# EAGLE design old_line_kick (EAGLE 7.7.0)
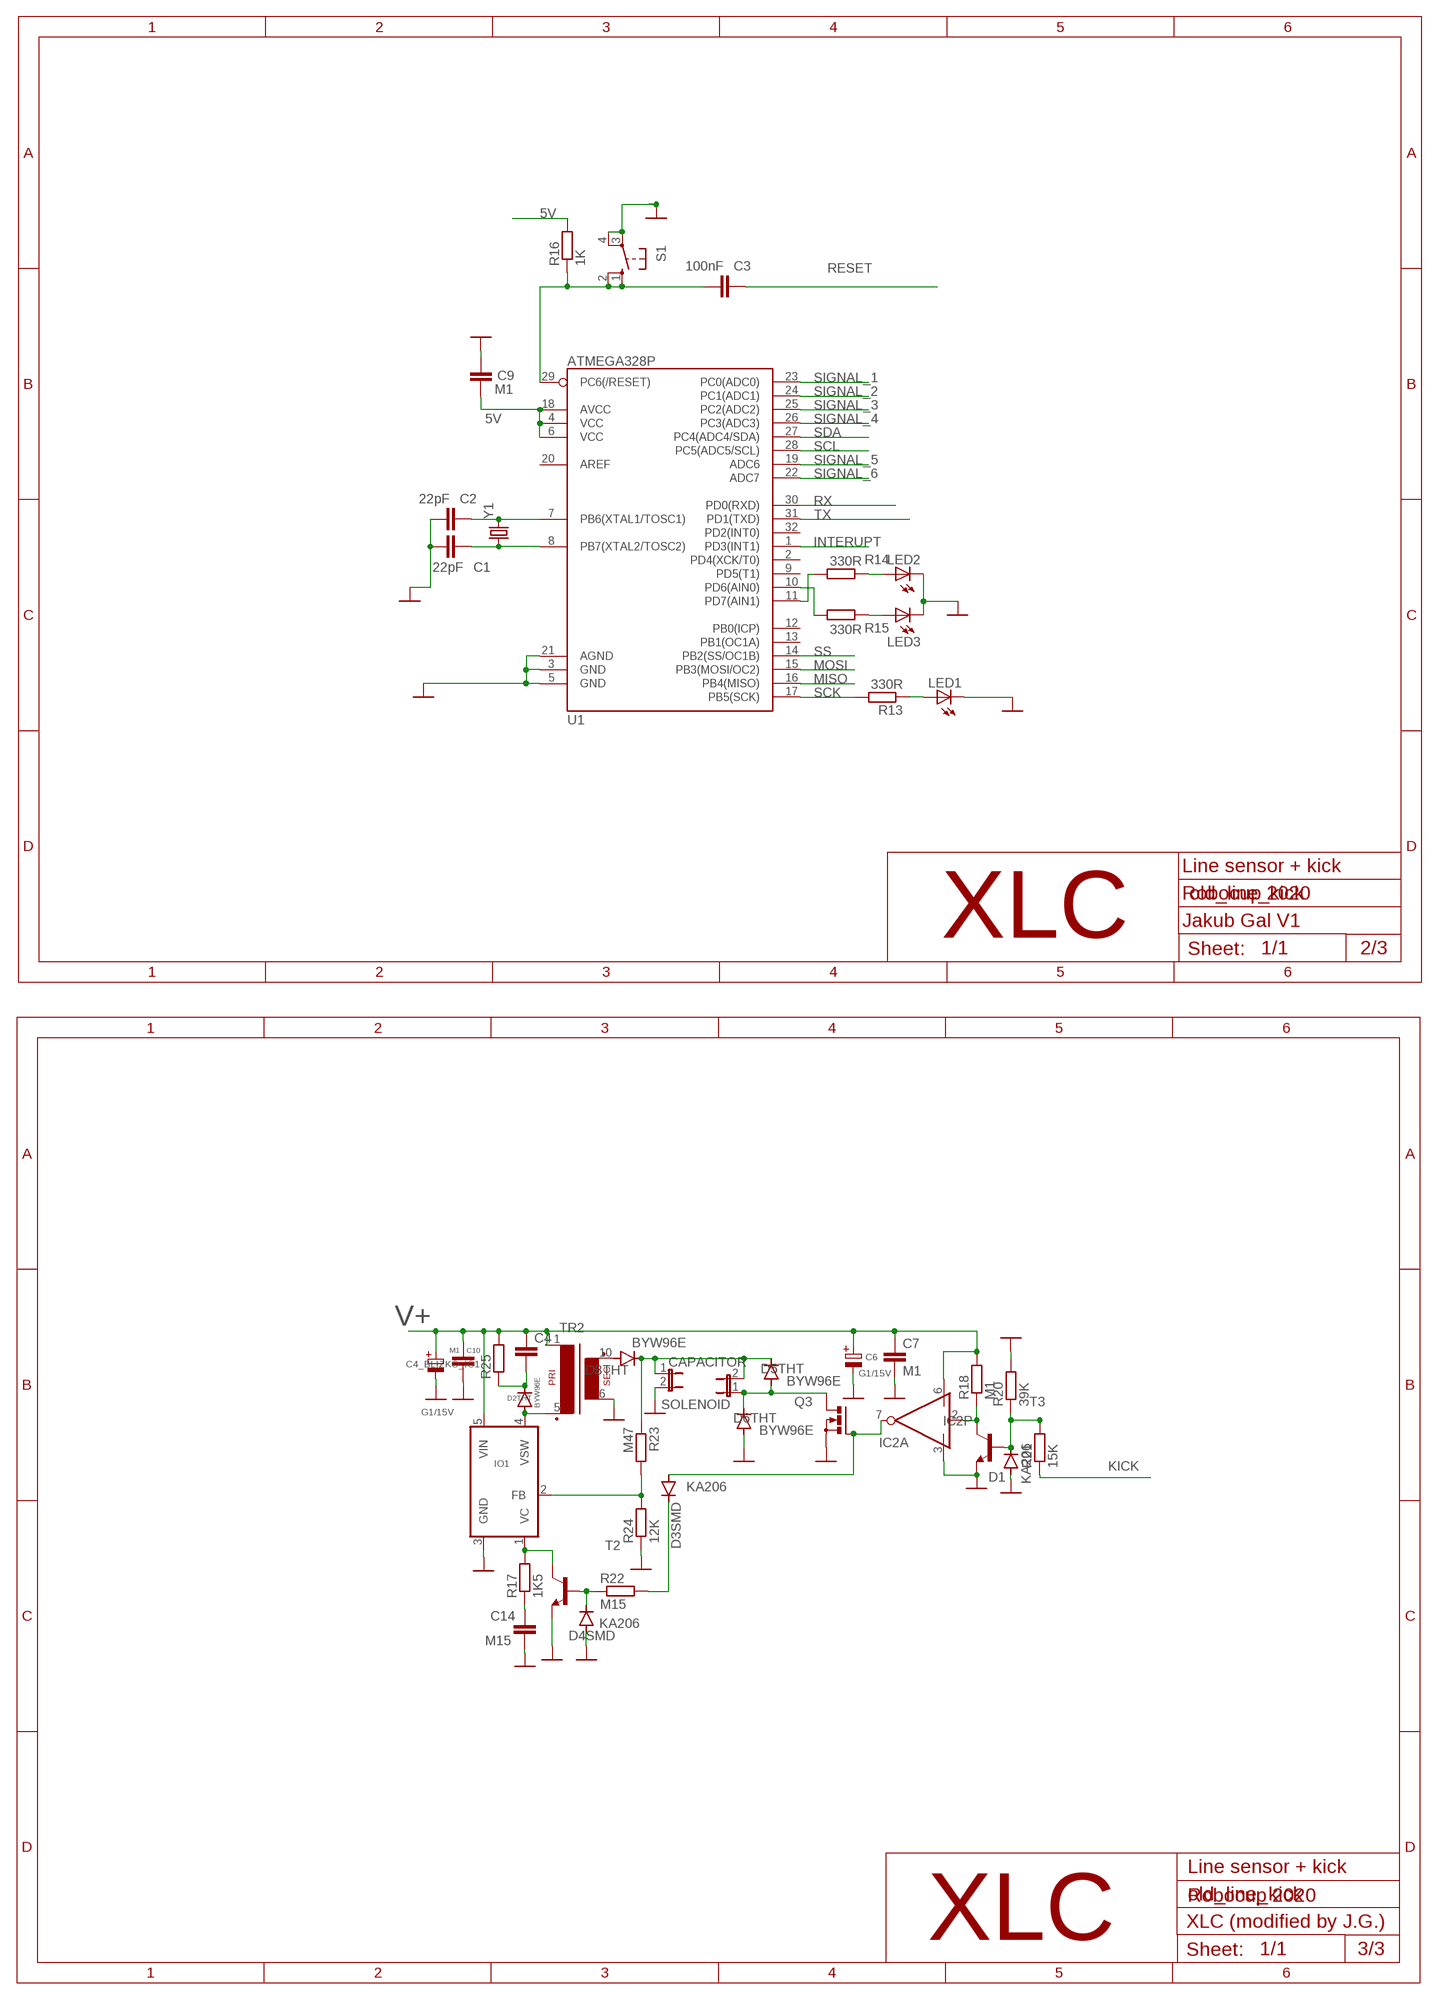
[diagram p0: schematic, sheet 1, part 1 of 2]
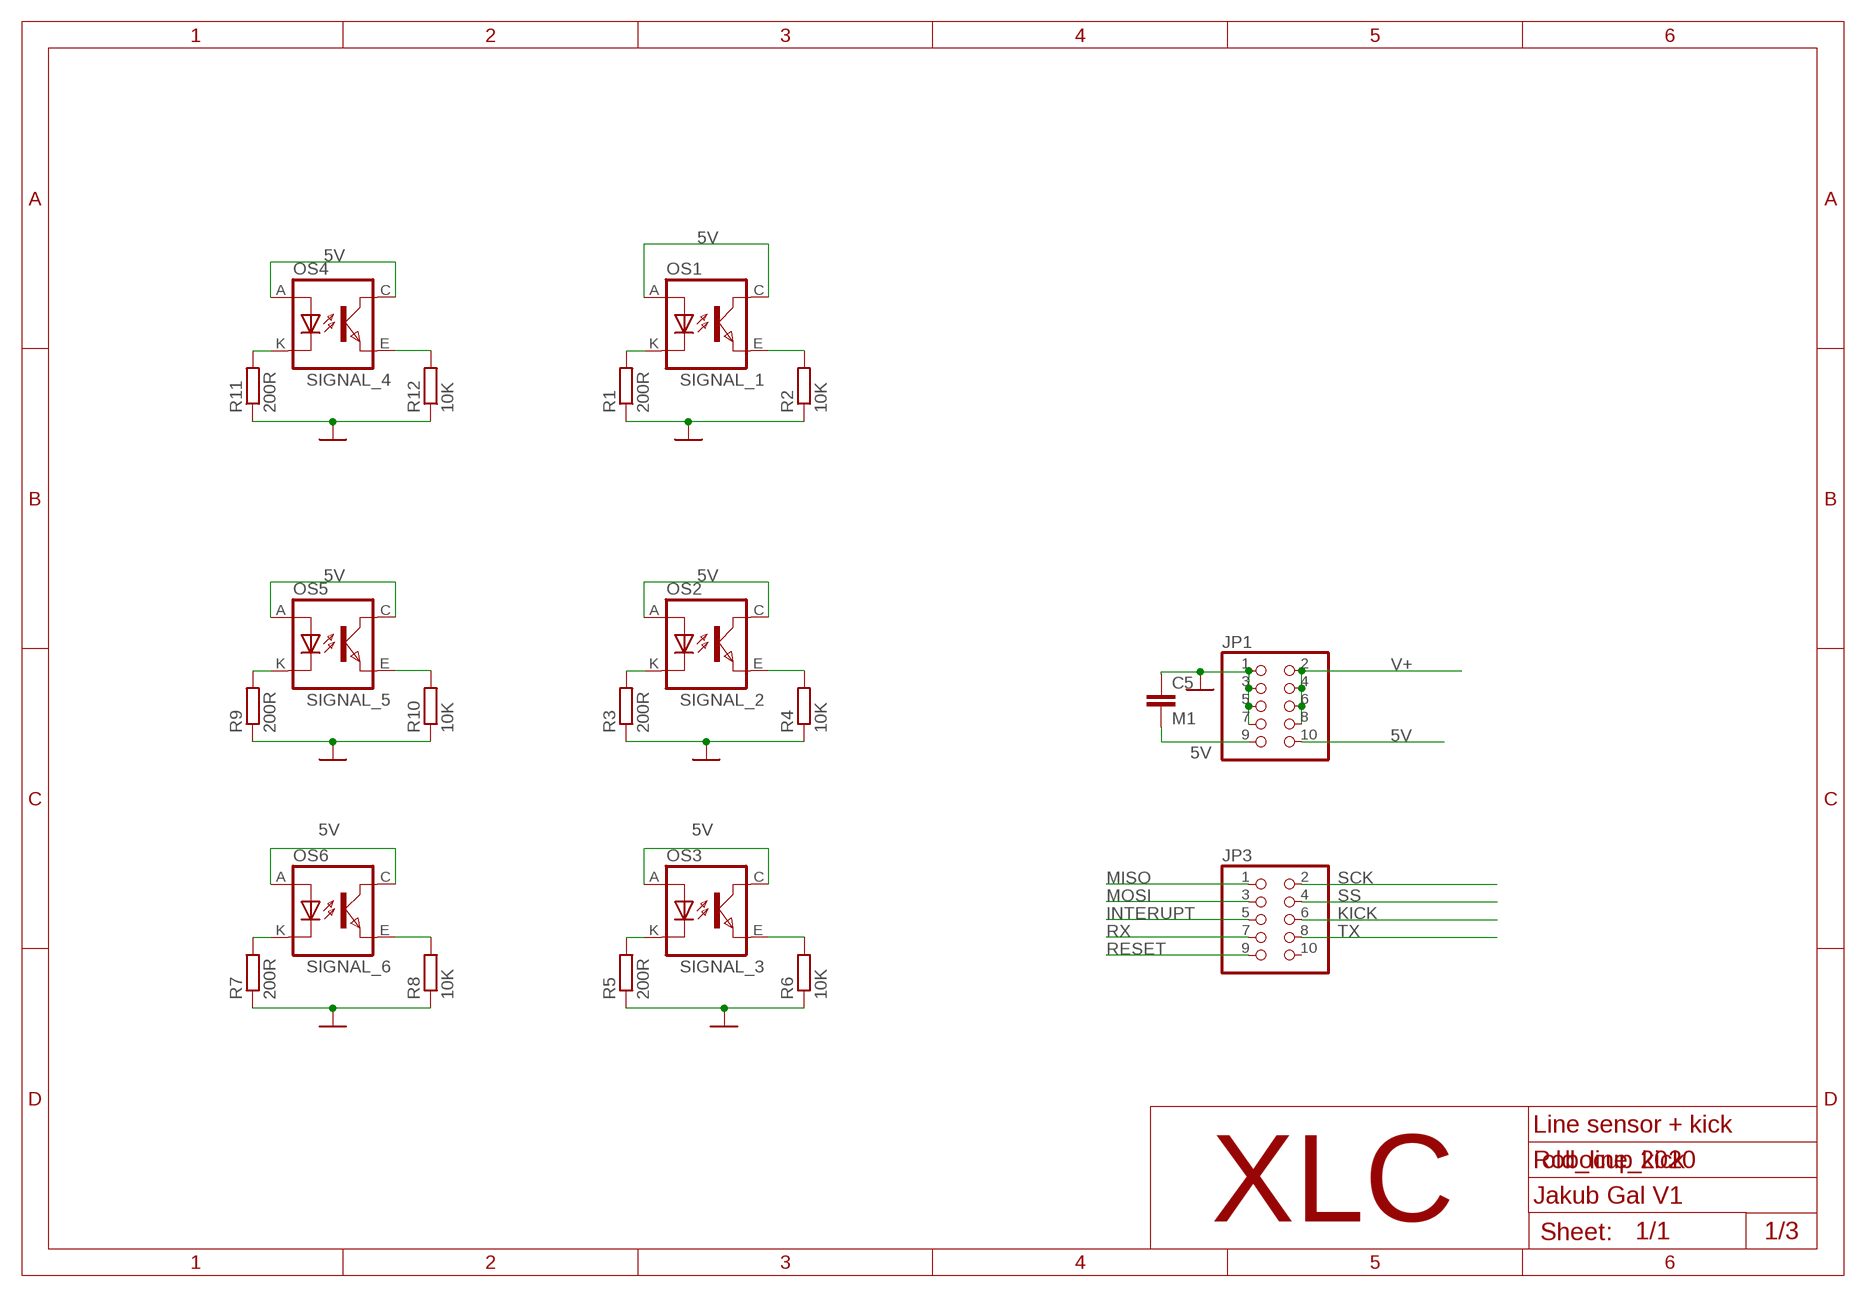
[diagram p1: schematic, sheet 1, part 2 of 2]

## Parts
C1  22pF  C-EUC0603  [C0603]
C2  22pF  C-EUC0603  [C0603]
C3  100nF  C-EUC0603  [C0603]
C4  C-EU075-052X106  [C075-052X106]
C4_BLIZKO_IO1  G1/15V  KOND-ELEKT-2,5/7  [E-2,5/7-RAD]
C5  M1  C-EUC0603  [C0603]
C6  G1/15V  KOND-ELEKT-2,5/7  [E-2,5/7-RAD]
C7  M1  C-EUC0805K  [C0805K]
C9  M1  C-EUC0603  [C0603]
C10  M1  C-EUC0805K  [C0805K]
C14  M15  C-EUC0805K  [C0805K]
CAPACITOR  JP1E  [JP1]
D1  KA206  DIODE-D-7.5  [D-7.5]
D2THT  BYW96E  BYW96  [SOD64-10]
D3SMD  KA206  DIODE-D-7.5  [D-7.5]
D4SMD  KA206  DIODE-D-7.5  [D-7.5]
D5THT  BYW96E  BYW96  [SOD64-10]
D6THT  BYW96E  BYW96  [SOD64-10]
D8THT  BYW96E  BYW96  [SOD64-10]
IC2  MIC4423BM  [SO08]
IO1  LT1071V  [TO220-5P]
JP1  PINHD-2X5IDC  [2X05_IDC]
JP3  PINHD-2X5IDC  [2X05_IDC]
LED1  LEDCHIPLED_0603  [CHIPLED_0603]
LED2  LEDCHIPLED_0603  [CHIPLED_0603]
LED3  LEDCHIPLED_0603  [CHIPLED_0603]
OS1  TCRT5000  [TCRT5000]
OS2  TCRT5000  [TCRT5000]
OS3  TCRT5000  [TCRT5000]
OS4  TCRT5000  [TCRT5000]
OS5  TCRT5000  [TCRT5000]
OS6  TCRT5000  [TCRT5000]
Q3  PMOSFET_NTO220BV  [TO220BV]
R1  200R  R-EU_R0603  [R0603]
R2  10K  R-EU_R0603  [R0603]
R3  200R  R-EU_R0603  [R0603]
R4  10K  R-EU_R0603  [R0603]
R5  200R  R-EU_R0603  [R0603]
R6  10K  R-EU_R0603  [R0603]
R7  200R  R-EU_R0603  [R0603]
R8  10K  R-EU_R0603  [R0603]
R9  200R  R-EU_R0603  [R0603]
R10  10K  R-EU_R0603  [R0603]
R11  200R  R-EU_R0603  [R0603]
R12  10K  R-EU_R0603  [R0603]
R13  330R  R-EU_R0603  [R0603]
R14  330R  R-EU_R0603  [R0603]
R15  330R  R-EU_R0603  [R0603]
R16  1K  R-EU_R0603  [R0603]
R17  1K5  R-EU_R1206  [R1206]
R18  M1  R-EU_R1206  [R1206]
R20  39K  R-EU_R1206  [R1206]
R21  15K  R-EU_R1206  [R1206]
R22  M15  R-EU_R1206  [R1206]
R23  M47  R-EU_R1206  [R1206]
R24  12K  R-EU_R1206  [R1206]
R25  REZISTOR-7,5MM-HORIZ  [R-7,5H]
S1  10-XX  [B3F-10XX]
SOLENOID  JP1E  [JP1]
T2  -NPN-SC59-BEC  [SC59-BEC]
T3  -NPN-SC59-BEC  [SC59-BEC]
TR2  TRAFO-E10-R""  [TRAFO-EE17X20]
U1  ATMEGA328P  ATMEGA328_SMT  [TQFP32-08]
Y1  CRYSTALHC49US  [HC49US]

## Nets
5V: C5.2 C9.1 JP1.9 JP1.10 OS1.A(ANODE) OS1.C(COLLECTOR) OS2.A(ANODE) OS2.C(COLLECTOR) OS3.A(ANODE) OS3.C(COLLECTOR) OS4.A(ANODE) OS4.C(COLLECTOR) OS5.A(ANODE) OS5.C(COLLECTOR) OS6.A(ANODE) OS6.C(COLLECTOR) R16.2 U1.4(VCC) U1.6(VCC) U1.18(AVCC)
GND: C1.1 C2.1 C4_BLIZKO_IO1.- C5.1 C6.- C7.2 C9.2 C10.2 C14.2 CAPACITOR.2 D1.A D4SMD.A D6THT.A IC2.3(P:GND) IO1.3(GND) JP1.1 JP1.3 JP1.5 JP1.7 LED1.C LED2.C LED3.C Q3.S R1.1 R2.1 R3.1 R4.1 R5.1 R6.1 R7.1 R8.1 R9.1 R10.1 R11.1 R12.1 R20.2 R24.1 S1.3(P) S1.4(P1) T2.E T3.E TR2.6 U1.3(GND) U1.5(GND) U1.21(AGND)
INTERUPT: JP3.5 U1.1(PD3(INT1))
KICK: JP3.6 R21.1
MISO: JP3.1 U1.16(PB4(MISO))
MOSI: JP3.3 U1.15(PB3(MOSI/OC2))
N$1: OS1.K(CATHODE) R1.2
N$2: OS2.K(CATHODE) R3.2
N$3: OS3.K(CATHODE) R5.2
N$4: OS6.K(CATHODE) R7.2
N$5: OS5.K(CATHODE) R9.2
N$6: OS4.K(CATHODE) R11.2
N$7: C2.2 U1.7(PB6(XTAL1/TOSC1)) Y1.2
N$8: C1.2 U1.8(PB7(XTAL2/TOSC2)) Y1.1
N$9: IO1.1(VC) R17.2 T2.C
N$10: C14.1 R17.1
N$11: D8THT.A TR2.10
N$12: D3SMD.A IC2.7(A:OUT) Q3.G
N$13: CAPACITOR.1 D5THT.C D8THT.C R23.1 SOLENOID.2
N$14: IO1.2(FB) R23.2 R24.2
N$15: D4SMD.C R22.1 T2.B
N$16: C3.1 R16.1 S1.1(S) S1.2(S1) U1.29(PC6(/RESET))
N$17: LED1.A R13.1
N$18: IC2.2(A:IN) R18.1 T3.C
N$19: LED2.A R14.1
N$20: R15.2 U1.10(PD6(AIN0))
N$21: LED3.A R15.1
N$22: R14.2 U1.11(PD7(AIN1))
N$23: D2THT.A IO1.4(VSW) TR2.5
N$24: C4.2 D2THT.C R25.1
N$26: D5THT.A D6THT.C Q3.D SOLENOID.1
N$29: D3SMD.C R22.2
N$31: D1.C R20.1 R21.2 T3.B
RESET: C3.2 JP3.9
RX: JP3.7 U1.30(PD0(RXD))
SCK: JP3.2 R13.2 U1.17(PB5(SCK))
SCL: U1.28(PC5(ADC5/SCL))
SDA: U1.27(PC4(ADC4/SDA))
SIGNAL_1: OS1.E(EMITTER) R2.2 U1.23(PC0(ADC0))
SIGNAL_2: OS2.E(EMITTER) R4.2 U1.24(PC1(ADC1))
SIGNAL_3: OS3.E(EMITTER) R6.2 U1.25(PC2(ADC2))
SIGNAL_4: OS4.E(EMITTER) R12.2 U1.26(PC3(ADC3))
SIGNAL_5: OS5.E(EMITTER) R10.2 U1.19(ADC6)
SIGNAL_6: OS6.E(EMITTER) R8.2 U1.22(ADC7)
SS: JP3.4 U1.14(PB2(SS/OC1B))
TX: JP3.8 U1.31(PD1(TXD))
V+: C4.1 C4_BLIZKO_IO1.+ C6.+ C7.1 C10.1 IC2.6(P:V+) IO1.5(VIN) JP1.2 JP1.4 JP1.6 JP1.8 R18.2 R25.2 TR2.1
Unconnected: IC2.4(B:IN) IC2.5(B:OUT) JP3.10 U1.2(PD4(XCK/T0)) U1.9(PD5(T1)) U1.12(PB0(ICP)) U1.13(PB1(OC1A)) U1.20(AREF) U1.32(PD2(INT0))

## Notes on the sheet
- Line sensor + kick
- Robocup 2020
- Jakub Gal V1
- XLC
- 2/3
- Line sensor + kick
- Robocup 2020
- XLC (modified by J.G.)
- XLC
- 3/3
- Line sensor + kick
- Robocup 2020
- Jakub Gal V1
- XLC
- 1/3

## Library data of the parts
C1-C3 C9 = rcl@1:C-EU: CAPACITOR, European symbol
C4 C5 = rcl:C-EU: CAPACITOR, European symbol; SPICEPREFIX: C
C4_BLIZKO_IO1 C6 = TABOR K1:KOND-ELEKT: Kondenzátor elektrolyticky
C7 C10 C14 = resistor:C-EU: CAPACITOR, European symbol
CAPACITOR SOLENOID = jumper:JP1E: JUMPER
D1 D3SMD D4SMD = diode:DIODE-: DIODE
D2THT D5THT D6THT D8THT = diode:BYW96: DIODE fast soft-recovery rectifier
IC2 = TABOR K1:MIC4423B: 2x Invertor driver MOSFET
IO1 = TABOR K1:LT1071: DC/DC pulzny IO
JP1 JP3 = pinhead-1:PINHD-2X5: PIN HEADER
LED1-LED3 = audio amplifier example:LED
OS1-OS3 OS5 = tcrt5000:TCRT5000
OS4 OS6 = tcrt5000:TCRT5000; SPICEPREFIX: O
Q3 = transistor-power:PMOSFET_N: Power MOSFET N-Channel
R1-R18 R20-R24 = rcl:R-EU_: RESISTOR, European symbol; SPICEPREFIX: R
R25 = TABOR K1:REZISTOR: REZISTOR
S1 = switch-omron:10-XX: OMRON SWITCH; MPN: B3F-1000; OC_FARNELL: 176432; OC_NEWARK: 36M3542
T2 T3 = DC_LOAD_AU:*-NPN-: NPN Transistror BF959 corrected 2008.03.06
TR2 = TABOR K1:TRAFO-E10-R: Transformátor s feritovym jadrom EE17x20: 1x primár, 1x sekundár
U1 = SparkFun-DigitalIC:ATMEGA328_SMT: 32-Pin Atmega328 part Commonly used on Arduino compatible boards Available in QFP and QFN packages TQFP is IC-09069 QFN is non-stock; PROD_ID: IC-09069
Y1 = SparkFun-FreqCtrl:CRYSTAL: Various standard crystals. Proven footprints. Spark Fun Electronics SKU : COM-00534

## Board
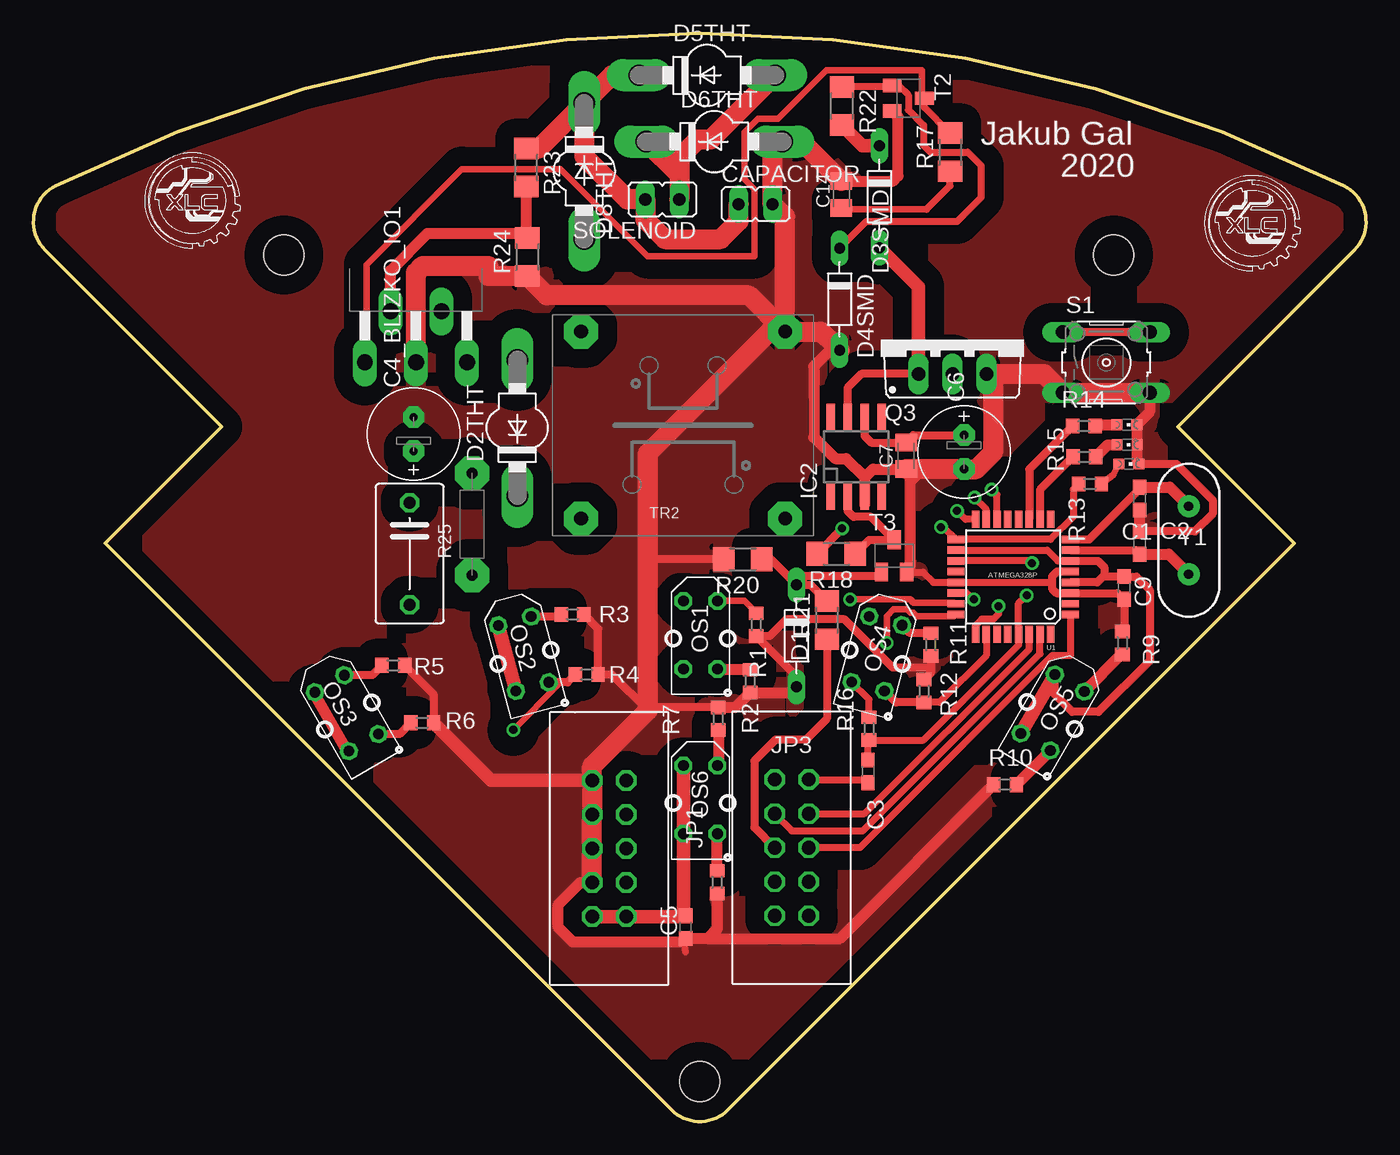
[diagram p2: board, top side]
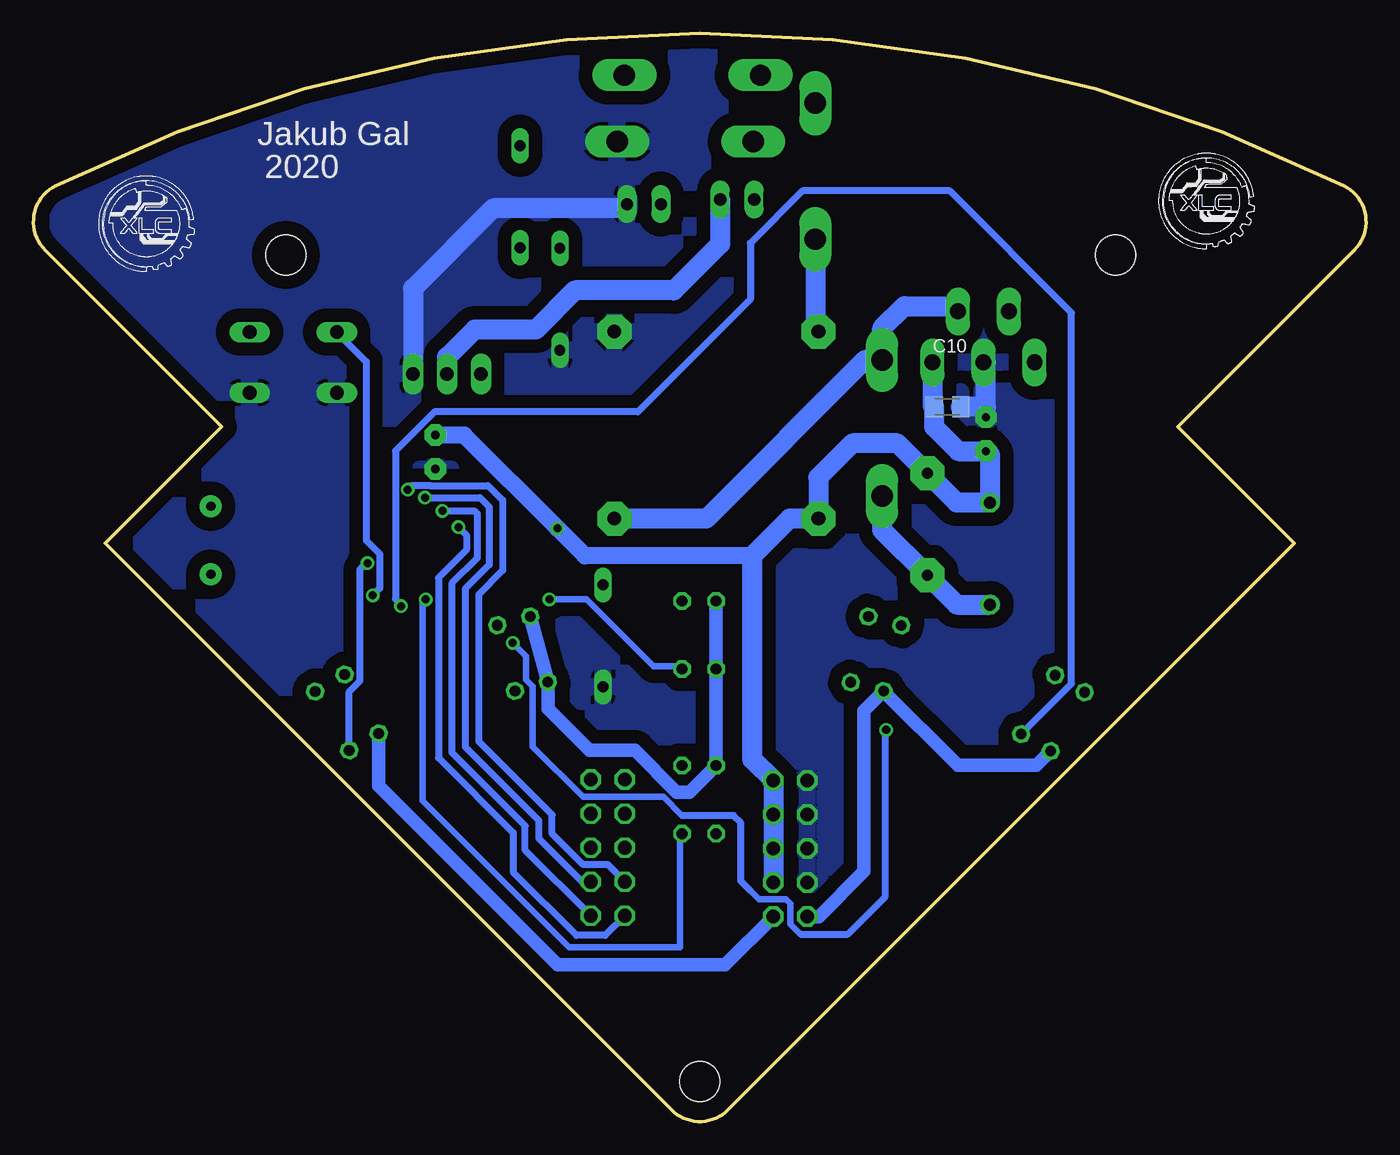
[diagram p3: board, bottom side, seen from below]

Size 99.55 x 81.25 mm. Coordinates in mm from the lower left corner, seen from the top.
Outline: 85.49,51.89 98.67,65.08 arc108 97.9,69.88 arc53 1.66,69.88 arc108 0.88,65.08 14.07,51.89 5.35,43.18 47.66,0.87 arc90 51.9,0.87 94.2,43.18 85.49,51.89
Copper layers (1*16): Top 0.035mm / dielectric 1.5mm / Bottom 0.035mm
Design rules "default *": minimum track width 0.5mm, minimum drill 0.6mm, track to track 6mil, track to pad 6mil, pad to pad 6mil, via to via 6mil, smd to smd 6mil, copper to edge 40mil, drill to drill 6mil, minimum pad ring 10mil, minimum via ring 8mil, stop-mask expansion 4mil, vias tented up to drill 0mil, thermal gap 10mil
Holes 3 mm at 49.78,3 18.71,64.71 80.71,64.71

### Footprints (pad centres in the part's own frame; a part is rotated, then mirrored left to right if it is on the bottom)
C0603 = smd 1.1 x 1: 1 -0.85,0; 2 0.85,0
C075-052X106 = drill 0.914 octagon: 1 -3.81,0; 2 3.81,0
E-2,5/7-RAD = drill 0.61 pad 1.6 octagon: + -1.27,0; - 1.27,0
C0805K = smd 1.3 x 1.6: 1 -1,0; 2 1,0
JP1 = drill 0.914 long: 1 0,-1.27; 2 0,1.27
D-7.5 = drill 0.813 long: A 3.81,0; C -3.81,0
SOD64-10 = drill 1.6 long: A 5.08,0; C -5.08,0
SO08 = smd 0.61 x 1.981: 1 -1.905,-2.972; 2 -0.635,-2.972; 3 0.635,-2.972; 4 1.905,-2.972; 5 1.905,2.972; 6 0.635,2.972; 7 -0.635,2.972; 8 -1.905,2.972
TO220-5P = drill 1.194 pad 1.676 long: 1 -3.81,0; 2 -1.905,3.81; 3 0,0; 4 1.905,3.81; 5 3.81,0
2X05_IDC = drill 1.016 octagon: 1 -5.08,-1.27; 2 -5.08,1.27; 3 -2.54,-1.27; 4 -2.54,1.27; 5 0,-1.27; 6 0,1.27; 7 2.54,-1.27; 8 2.54,1.27; 9 5.08,-1.27; 10 5.08,1.27
CHIPLED_0603 = smd 0.8 x 0.8: A 0,-0.75; C 0,0.75
TCRT5000 = drill 0.8 octagon: A -2.54,-1.27; C 2.54,-1.27; E 2.54,1.27; K -2.54,1.27
TO220BV = drill 1.016 long: D 0,-2.54; G -2.54,-2.54; S 2.54,-2.54
R0603 = smd 1 x 1.1: 1 -0.85,0; 2 0.85,0
R1206 = smd 1.6 x 1.803: 1 -1.422,0; 2 1.422,0
R-7,5H = drill 0.813 pad 2.54 octagon: 1 -3.81,0; 2 3.81,0
B3F-10XX = drill 1.016 long: 1 -3.251,2.261; 2 3.251,2.261; 3 -3.251,-2.261; 4 3.251,-2.261
SC59-BEC = smd 1 x 1.4: B -0.95,-1.2; C 0,1.2; E 0.95,-1.2
TRAFO-EE17X20 = drill 1.016 pad 2.54 octagon: 1 -7.62,-7.62; 5 7.62,-7.62; 6 7.62,6.35; 10 -7.62,6.35
TQFP32-08 = smd 1.27 x 0.559: 1 -4.293,2.8; 2 -4.293,2; 3 -4.293,1.2; 4 -4.293,0.4; 5 -4.293,-0.4; 6 -4.293,-1.2; 7 -4.293,-2; 8 -4.293,-2.8; 17 4.293,-2.8; 18 4.293,-2; 19 4.293,-1.2; 20 4.293,-0.4; 21 4.293,0.4; 22 4.293,1.2; 23 4.293,2; 24 4.293,2.8 | smd 0.559 x 1.27: 9 -2.8,-4.293; 10 -2,-4.293; 11 -1.2,-4.293; 12 -0.4,-4.293; 13 0.4,-4.293; 14 1.2,-4.293; 15 2,-4.293; 16 2.8,-4.293; 25 2.8,4.293; 26 2,4.293; 27 1.2,4.293; 28 0.4,4.293; 29 -0.4,4.293; 30 -1.2,4.293; 31 -2,4.293; 32 -2.8,4.293
HC49US = drill 0.7 pad 1.651: 1 -2.54,0; 2 2.54,0

### Placement (x,y rotation side)
C1  82.63,46.52 90 top
C2  82.63,43.22 270 top
C3  62.34,26.16 270 top
C4  28.1,42.41 270 top
C4_BLIZKO_IO1  28.4,51.34 90 top
C5  48.72,14.52 90 top
C6  69.53,50 270 top
C7  65.19,49.72 270 top
C9  81.48,39.85 270 top
C10  31.27,53.38 0 bottom
C14  60.36,69.23 90 top
CAPACITOR  53.95,68.51 270 top
D1  57.01,36.27 270 top
D2THT  36.15,51.8 90 top
D3SMD  63.2,69.07 270 top
D4SMD  60.23,61.41 270 top
D5THT  50.32,78.14 0 top
D6THT  50.86,73.19 0 top
D8THT  41.14,70.97 270 top
IC2  61.46,49.66 0 top
IO1  28.57,56.69 0 top
JP1  43.01,20.39 270 top
JP3  56.64,20.45 90 top
LED1  81.83,49.11 270 top
LED2  81.68,52.04 270 top
LED3  81.7,50.54 270 top
OS1  49.83,36.34 270 top
OS2  36.61,34.93 285 top
OS3  23.4,30.5 300 top
OS4  63.01,34.94 255 top
OS5  76.13,30.54 240 top
OS6  49.83,24.04 270 top
Q3  68.66,58.37 0 top
R1  54,37.11 90 top
R2  53.54,32.89 90 top
R3  40.27,37.87 180 top
R4  41.33,33.38 180 top
R5  26.89,34.07 180 top
R6  29.04,29.78 180 top
R7  51.16,30.08 270 top
R8  51.08,17.88 90 top
R9  81.35,35.74 270 top
R10  72.58,25.16 0 top
R11  67.04,35.62 90 top
R12  66.53,32.15 270 top
R13  78.93,47.62 180 top
R14  78.47,51.94 180 top
R15  78.51,49.64 180 top
R16  62.42,29.34 90 top
R17  68.48,72.39 90 top
R18  59.98,42.4 180 top
R20  52.98,41.99 180 top
R21  59.27,37.44 90 top
R22  60.4,75.84 270 top
R23  36.82,71.24 270 top
R24  36.89,64.57 90 top
R25  32.77,44.6 90 top
S1  80.15,56.69 0 top
SOLENOID  46.98,68.86 90 top
T2  65.36,76.42 270 top
T3  64.3,42.24 0 top
TR2  48.53,52.65 0 top
U1  73.19,40.67 180 top
Y1  86.31,43.41 270 top

### Tracks (layer width: path | path; a pad name or v marks a point on that pad's centre or on a via)
5V
  Top 0.508: U1.18 75.73,42.67 76.53,41.87 U1.6 | R16.2 62.42,31.52 OS4.C
  Top 0.61: U1.6 79.53,41.87 80,41.4 80,40.8 | 80,40.8 79.47,40.27 U1.4 | 80,40.8 80.1,40.7 C9.1 82.4,40.7 83.4,39.7 83.4,34.42 79.57,30.6 77.6,30.6 76.3,31.89 OS5.A
  Top 0.813: 48.66,15.31 C5.2 | OS3.A 21.03,31.86 23.3,27.94 OS3.C
  Top 1.016: JP1.9 JP1.10 48.66,15.31 | C5.2 48.56,15.53 OS6.C OS6.A | OS2.A OS2.C | OS5.C OS5.A
  Bottom 1.016: OS1.A OS1.C OS6.A 50.54,24.6 51.51,24.6 54.62,27.71 58.02,27.71 61.12,30.81 OS4.C OS4.A | JP1.9 40.89,15.31 37.5,18.7 37.5,30.69 OS2.C 30.49,26.6 24.63,26.6 OS3.C | JP1.10 47.88,11.7 60.39,11.7 73.76,25.08 OS5.C
GND
  Top 0.5: IC2.3 62.25,46.75 62.1,46.75 | C5.1 48.6,13.37 48.72,12.63
  Top 0.508: T3.E 66.46,41.04 67.23,40.27 U1.21 76.03,40.27 76.1,40.2
  Top 0.61: U1.5 76.47,41.07 76.1,40.7 76.1,40.2 76.1,39.79 76.42,39.47 U1.3 81.01,39.47 C9.2 81.48,36.72 R9.1 | LED1.C 85.39,49.11 88.1,46.4 88.1,45.4 86.77,44.07 C2.1 | R7.1 46.13,30.93 45.9,30.7 43.22,33.38 R4.1 42.18,36.81 R3.1 | R5.1 29.89,31.92 R6.1 | R11.1 67.04,33.9 | 67.04,33.9 67.04,33.51 R12.1 | 67.04,33.9 64.2,33.9 60.6,37.5 56.24,37.5 55,36.26 R1.1 57.01,33.25 D1.A | R20.2 46.09,41.99 45.9,41.8
  Top 0.813: LED1.C 82.45,49.24 LED3.C 82.45,52.02 LED2.C 83.4,53.01 S1.4 | R8.1 51.08,14.38 50.37,13.67 | 50.37,13.67 C5.1 48.45,13.4 40.3,13.4 39.2,14.5 39.2,16.2 40.85,17.85 | R7.1 52.43,30.93 R2.1 56.59,32.04 D1.A | C14.2 64.23,70.23 64.6,70.6 64.6,75.03 T2.E | 59.86,57.96 58.3,56.4 58.3,51.1 59.9,49.5 60.7,49.5 62.1,48.1 | 62.1,46.1 62.1,46.75 62.1,48.1 | C1.1 C2.1 | 62.1,48.1 62.72,48.72 C7.2 | T3.E 65.5,41.29 65.5,47.82 66.4,48.72 | 50.37,13.67 60.24,13.67 R10.1
  Top 1.016: R6.1 34.2,25.47 JP1.1
  Top 1.5: IO1.3 28.57,63.39 29.08,63.9 34,63.9 34,63.14 R24.1 38.34,61.7 53.45,61.7 TR2.6 | TR2.6 58.83,59 59.86,57.96 D4SMD.A | TR2.6 56.15,67.58 CAPACITOR.2 55.22,72.47 D6THT.A 57.4,73.19 C14.2 | TR2.6 55,59 45.9,49.9 45.9,41.8 45.9,30.7 41.74,26.54 JP1.1 JP1.3 JP1.5 JP1.7 | S1.4 S1.3 75.5,55.83 Q3.S 71.7,55.33 71.7,50 70.43,48.73 C6.- 66.4,48.72 C7.2
  Bottom 1.5: C4_BLIZKO_IO1.- 28.4,53.38 | 28.4,53.38 C10.2 | 28.4,53.38 28.4,56.69 IO1.3 | CAPACITOR.2 55.53,68.2 65.2,68.2 71.2,62.2 Q3.S
  pour Bottom (isolate 1): -9,-8.79 108,-8.79 108,83.3 -9,83.3
  pour Top (isolate 1.422): -10,80 -10,-10 110,-10 110,80 110,90 -10,90
INTERUPT
  Top 0.508: U1.1 77.48,34.8 76.1,34.8 61.75,20.45 JP3.5
KICK
  Top 0.61: R21.1 59.27,30.09 57.7,28.52 55.44,28.52 53.85,26.93 53.85,21.97 JP3.6
MISO  (via drill 0.6)
  Top 0.508: U1.16 69.64,44.96 v69,45.6
  Bottom 0.508: v69,45.6 66.6,45.6 66.4,45.4 66.4,42.08 68.3,40.18 68.3,27.57 62.81,22.08 62.81,20.27 JP3.1
MOSI  (via drill 0.6)
  Top 0.508: U1.15 71.19,45.71 v70.3,46.6
  Bottom 0.508: v70.3,46.6 66.2,46.6 65.5,45.9 65.5,41.57 67.3,39.77 67.3,27.98 61.81,22.49 61.81,21.16 58.55,17.91 JP3.3
N$1
  Top 0.5: R1.2 54,38 53.12,38.87 51.12,38.87 OS1.K
N$2
  Top 0.61: R3.2 39.26,37.71 OS2.K
N$3
  Top 0.61: R5.2 25.3,33.33 OS3.K
N$4
  Top 0.5: 50.75,26.62 51,26.62 OS6.K
  Top 0.813: R7.2 51.16,26.78 51,26.62
N$5
  Top 0.813: OS5.K 81.28,34.89 R9.2
N$6
  Top 0.61: R11.2 65.49,36.47 OS4.K
N$7
  Top 0.61: U1.7 82.33,42.67 C2.2
  Top 0.813: C2.2 84.81,42.37 Y1.2
N$8
  Top 0.61: U1.8 78.88,43.47 82.63,47.21 C1.2
  Top 0.813: C1.2 84.89,47.37 Y1.1
N$9
  Top 0.5: T2.C 66.37,76.87 66.37,78.5 59.25,78.5 55.62,74.87 54.12,74.87 53.12,73.87 53.12,70.37 53.87,69.62 53.87,64.62 45.87,64.62 39.37,71.12 32,71.12 24.87,64 24.87,56.75 IO1.1
  Top 0.508: R17.2 66.56,75.73 T2.C
N$10
  Top 0.5: 66.72,68.12 60.46,68.12 C14.1 | R17.1 68.53,71.13
  Top 0.508: 66.72,68.12 68.48,69.88 R17.1
N$11
  Bottom 1.5: D8THT.A 41.14,59.23 TR2.10
N$12
  Top 0.61: Q3.G 61.86,55.83 60.82,54.79 IC2.7
  Top 1.016: Q3.G 66.12,62.34 D3SMD.A
N$13
  Top 1.5: D8THT.C 37.75,72.66 R23.1 | D8THT.C 41.14,72.09 44.37,68.86 SOLENOID.2 45.71,67.36 47.17,65.9 51.34,65.9 52.68,67.24 CAPACITOR.1 | D8THT.C 43.23,78.14 D5THT.C
N$14
  Top 0.813: IO1.2 26.66,63.54 29.44,66.32 36.56,66.32 R24.2 36.82,66.06 R23.2
N$15
  Top 0.508: R22.1 64.05,77.26 T2.B 64.66,77.37 65.35,76.67 65.35,75.55 66.5,74.4 66.5,72.9 67,72.4 69.8,72.4 70.8,71.4 70.8,69 69,67.2 62.21,67.2 D4SMD.C
N$16  (via drill 0.6)
  Top 0.508: v74.2,39.3 73.59,38.69 U1.29 73.59,35.58 66.49,28.49 R16.1 62.34,28.41 C3.1
  Top 0.61: S1.2 S1.1
  Bottom 0.508: S1.1 74.7,56.75 74.7,43.4 73.69,42.39 73.69,39.81 v74.2,39.3
N$17
  Top 0.5: LED1.A 80.67,48.28 R13.1
N$18
  Top 0.61: IC2.2 60.82,45.59 61.26,45.15 62.58,45.15 T3.C 62.44,43.44 R18.1
N$19
  Top 0.5: R14.1 79.43,52.05
  Top 0.813: R14.1 79.42,52.04 LED2.A
N$20
  Top 0.61: R15.2 75.19,47.17 U1.10
N$21
  Top 0.5: 79.45,49.72 R15.1
  Top 0.813: R15.1 80.26,50.54 LED3.A
N$22
  Top 0.61: R14.2 74.39,48.71 U1.11
N$23
  Bottom 1.5: IO1.4 30.87,60.9 34.48,60.9 36.15,59.23 D2THT.A 37.43,56.88 49.28,45.03 TR2.5
N$24
  Bottom 1.5: D2THT.C 36.15,44.17 R25.1 30.58,38.6 C4.2
N$26
  Top 1.5: D5THT.A 50.59,73.33 49.62,73.33 48.25,71.96 SOLENOID.1 48.25,70.72 D6THT.C
  Bottom 1.5: SOLENOID.1 48.25,65.53 51.71,62.07 59.1,62.07 62.02,59.15 66.59,59.15 68.66,57.08 Q3.D
N$29
  Top 1.016: R22.2 61.94,72.88 D3SMD.C
N$31
  Top 0.61: D1.C 57.66,40.73 63.04,40.73 T3.B | D1.C 58.05,40.08 R21.2 | R20.1 55.1,41.99 D1.C
RESET
  Top 0.508: 62.32,25.33 C3.2 62.12,25.53 JP3.9
RX
  Top 0.508: JP3.7 62.09,22.99 74.39,35.29 U1.30
SCK  (via drill 0.6)
  Top 0.508: R13.2 77.67,47.21 77.67,45.16 75.99,43.47 U1.17 67.97,44.4 v67.8,44.4
  Bottom 0.508: v67.8,44.4 67.2,43.8 67.2,42.7 69.3,40.6 69.3,27.15 63.72,21.58 63.72,18.63 58.99,13.9 56.84,13.9 JP3.2
SIGNAL_1  (via drill 0.6)
  Top 0.5: v61,39 65.5,39 65.75,38.75 68.75,38.75 U1.23
  Top 0.813: R2.2 51.16,33.74 OS1.E
  Bottom 0.5: v61,39 58.25,39 53.25,34 51.25,34 OS1.E
SIGNAL_2  (via drill 0.6)
  Top 0.5: v63.75,35.75 63.75,37.75 64.25,38.25 65.25,38.25 65.5,38 65.75,38 66,37.75 68.75,37.75 U1.24 | v35.85,29.25 39.24,32.64 OS2.E
  Top 0.61: R4.2 39.9,32.8 OS2.E
  Bottom 0.5: v63.75,35.75 62.75,34.75 62.75,33 62.25,32.5 62.25,28 58.5,24.25 52.5,24.25 51.1,22.85 | 46,17.25 45.35,16.6 43.35,16.6 43,16.25 43,14.75 42.25,14
  Bottom 0.508: 46,17.25 46.7,17.95 46.7,22.3 47.25,22.85 51.1,22.85 | 42.25,14 38.7,14 35.95,16.75 35.95,29.15 v35.85,29.25
SIGNAL_3  (via drill 0.6)
  Top 0.508: v72.1,38.5 72.1,37.9 71.72,37.52 70.84,37.52 70.39,37.06 U1.25
  Top 0.61: R6.2 27.34,28.93 OS3.E
  Bottom 0.508: OS3.E 22,32.7 22,60.4 31.1,69.5 42.1,69.5 46,65.6 46,61.4 54.4,53 69.6,53 72.51,50.09 72.51,39.01 72.1,38.6 v72.1,38.5
SIGNAL_4
  Top 0.508: U1.26 71.19,34.79 67.7,31.3 R12.2
  Top 0.61: R12.2 64.44,31.3 OS4.E
SIGNAL_5  (via drill 0.6)
  Top 0.508: U1.19 68.93,41.9 74.4,41.9 v74.6,41.7
  Top 0.813: R10.2 75.96,27.69 OS5.E
  Bottom 0.508: OS5.E 75.96,32.11 75.16,32.91 75.16,41.23 74.7,41.7 v74.6,41.7
SIGNAL_6  (via drill 0.6)
  Top 0.5: v70.25,39 69.75,39.5 69,39.5 U1.22
  Top 0.813: R8.2 51.08,21.48 OS6.E
  Bottom 0.5: v70.25,39 70.5,38.75 70.5,23.95 59.55,13 51.25,13 51.25,21.5 OS6.E
SS  (via drill 0.6)
  Top 0.508: U1.14 71.99,46.81 v71.6,47.2
  Bottom 0.508: v71.6,47.2 71.29,47.51 69.92,47.51 69.91,47.5 65.6,47.5 64.5,46.4 64.5,41.15 66.3,39.35 66.3,28.4 60.8,22.9 60.8,21.48 58.49,19.17 56.64,19.17 JP3.4
TX
  Top 0.508: JP3.8 56.66,21.7 61.96,21.7 75.16,34.9 75.19,34.9 U1.31
V+  (via drill 0.6)
  Top 0.61: IC2.6 62.09,51.21 62.6,50.71 C7.1 65.74,51.27 C6.+ | R18.2 60.41,44.25 v60.41,44.3
  Bottom 1.27: 45.84,42.25 58.36,42.25 v60.41,44.3 67.38,51.27 C6.+
  Bottom 1.5: IO1.5 32.38,53.49 C10.1 32.27,51.87 30.47,50.07 C4_BLIZKO_IO1.+ 28.1,49.77 C4.1 30.58,46.22 R25.2 35.01,50.65 38.37,50.65 40.91,48.11 TR2.1 43.06,45.03 45.84,42.25 45.84,27.03 JP1.2 JP1.4 JP1.6 JP1.8

### Text on the board
tNames: Jakub Gal | 2020
bNames: Jakub Gal | 2020